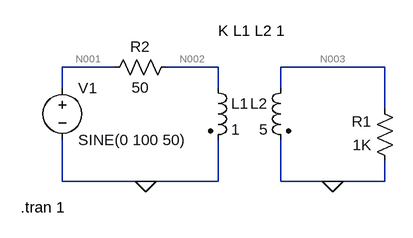
[diagram p0: schematic Exp-4.asc]
Exp-4.asc, the LTspice schematic file:
Version 4
SHEET 1 880 680
WIRE -32 64 -112 64
WIRE 128 64 48 64
WIRE 384 64 224 64
WIRE -112 96 -112 64
WIRE 128 96 128 64
WIRE 224 96 224 64
WIRE 384 128 384 64
WIRE -112 240 -112 176
WIRE 16 240 -112 240
WIRE 128 240 128 176
WIRE 128 240 16 240
WIRE 224 240 224 176
WIRE 304 240 224 240
WIRE 384 240 384 208
WIRE 384 240 304 240
FLAG 16 240 0
FLAG 304 240 0
SYMBOL res 400 224 R180
WINDOW 0 36 76 Left 2
WINDOW 3 36 40 Left 2
SYMATTR InstName R1
SYMATTR Value 1K
SYMBOL res -48 80 R270
WINDOW 0 32 56 VTop 2
WINDOW 3 0 56 VBottom 2
SYMATTR InstName R2
SYMATTR Value 50
SYMBOL ind2 112 80 R0
SYMATTR InstName L1
SYMATTR Value 1
SYMATTR Type ind
SYMBOL voltage -112 80 R0
WINDOW 123 0 0 Left 0
WINDOW 39 0 0 Left 0
SYMATTR InstName V1
SYMATTR Value SINE(0 100 50)
SYMBOL ind2 240 80 M0
SYMATTR InstName L2
SYMATTR Value 5
SYMATTR Type ind
TEXT -176 280 Left 2 !.tran 1
TEXT 128 8 Left 2 !K L1 L2 1

The netlist it stands for:
* Exp-4.asc
R1 0 N003 1K
R2 N001 N002 50
L1 N002 0 1
V1 N001 0 SINE(0 100 50)
L2 N003 0 5
.tran 1
K L1 L2 1
.backanno
.end

* Results of the author's LTspice run, read from the files saved beside the schematic
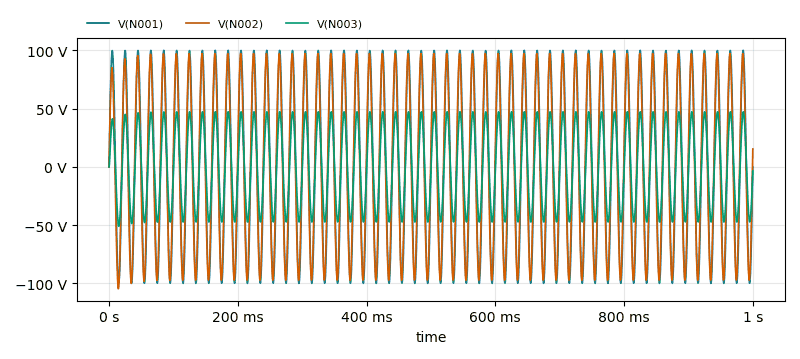
[diagram p1: Transient Analysis of Exp-4.asc, plotted from the saved traces]
* Transient Analysis, 1 run:
*   V(N001): min -100 V, max 100 V, average -76.3 µV, rms 70.9 V, last 0 V
*   V(N002): min -104.7 V, max 97.34 V, average -304.1 mV, rms 68.2 V, last 15.35 V
*   V(N003): min -51 V, max 47.31 V, average -149.7 mV, rms 33.18 V, last -3.544 V